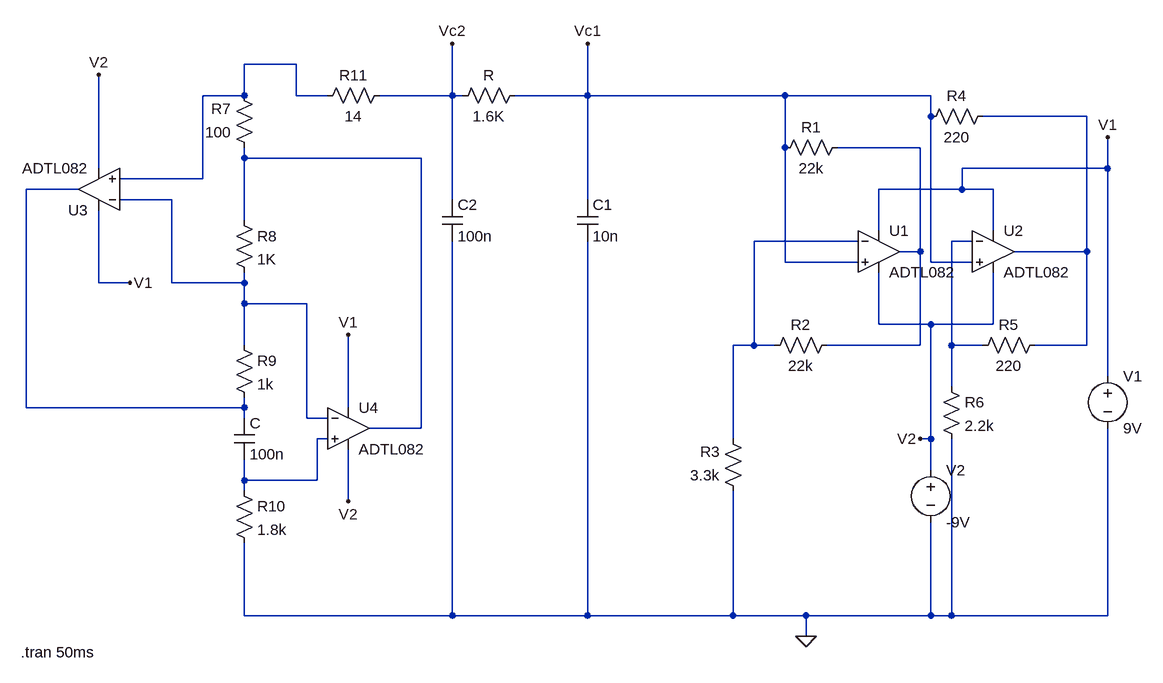
[diagram p0: schematic chua_circuit.asc]
chua_circuit.asc, the LTspice schematic file:
Version 4.1
SHEET 1 880 712
WIRE -592 -208 -672 -208
WIRE -672 -160 -672 -208
WIRE -672 -160 -736 -160
WIRE -592 -160 -592 -208
WIRE -544 -160 -592 -160
WIRE -352 -160 -352 -240
WIRE -352 -160 -464 -160
WIRE -336 -160 -352 -160
WIRE -144 -160 -144 -240
WIRE -144 -160 -256 -160
WIRE 160 -160 -144 -160
WIRE 384 -160 160 -160
WIRE 384 -128 384 -160
WIRE 624 -128 464 -128
WIRE 160 -80 160 -160
WIRE 368 -80 240 -80
WIRE -672 -64 -672 -80
WIRE -400 -64 -672 -64
WIRE -896 -48 -896 -192
WIRE 656 -48 656 -96
WIRE 656 -48 432 -48
WIRE -736 -32 -736 -160
WIRE -736 -32 -864 -32
WIRE -928 -16 -1008 -16
WIRE 432 -16 432 -48
WIRE 432 -16 304 -16
WIRE 480 -16 432 -16
WIRE -784 0 -864 0
WIRE -352 0 -352 -160
WIRE -144 0 -144 -160
WIRE -672 32 -672 -64
WIRE 304 48 304 -16
WIRE 480 48 480 -16
WIRE 272 64 112 64
WIRE 448 64 416 64
WIRE 368 80 368 -80
WIRE 368 80 336 80
WIRE 624 80 624 -128
WIRE 624 80 512 80
WIRE 160 96 160 -80
WIRE 272 96 160 96
WIRE 384 96 384 -128
WIRE 448 96 384 96
WIRE -896 128 -896 16
WIRE -848 128 -896 128
WIRE -784 128 -784 0
WIRE -672 128 -672 112
WIRE -672 128 -784 128
WIRE -672 160 -672 128
WIRE -576 160 -672 160
WIRE 304 192 304 112
WIRE 384 192 304 192
WIRE 480 192 480 112
WIRE 480 192 384 192
WIRE -672 224 -672 160
WIRE 112 224 112 64
WIRE 112 224 80 224
WIRE 144 224 112 224
WIRE 368 224 368 80
WIRE 368 224 224 224
WIRE 416 224 416 64
WIRE 464 224 416 224
WIRE 624 224 624 80
WIRE 624 224 544 224
WIRE 656 272 656 -48
WIRE 416 288 416 224
WIRE -1008 320 -1008 -16
WIRE -672 320 -672 304
WIRE -672 320 -1008 320
WIRE -512 320 -512 208
WIRE -672 336 -672 320
WIRE -576 336 -576 160
WIRE -544 336 -576 336
WIRE -400 352 -400 -64
WIRE -400 352 -480 352
WIRE -544 368 -560 368
WIRE 80 368 80 224
WIRE 384 368 384 192
WIRE 384 368 368 368
WIRE 384 416 384 368
WIRE -672 432 -672 400
WIRE -560 432 -560 368
WIRE -560 432 -672 432
WIRE -672 448 -672 432
WIRE -512 464 -512 384
WIRE -672 640 -672 528
WIRE -352 640 -352 64
WIRE -352 640 -672 640
WIRE -144 640 -144 64
WIRE -144 640 -352 640
WIRE 80 640 80 448
WIRE 80 640 -144 640
WIRE 192 640 80 640
WIRE 384 640 384 496
WIRE 384 640 192 640
WIRE 416 640 416 368
WIRE 416 640 384 640
WIRE 656 640 656 352
WIRE 656 640 416 640
WIRE 192 672 192 640
FLAG -848 128 V1
FLAG -512 208 V1
FLAG -512 464 V2
FLAG -896 -192 V2
FLAG -144 -240 Vc1
FLAG -352 -240 Vc2
FLAG 368 368 V2
FLAG 192 672 0
FLAG 656 -96 V1
SYMBOL OpAmps\\ADTL082 304 16 R0
SYMATTR InstName U1
SYMBOL OpAmps\\ADTL082 480 16 R0
SYMATTR InstName U2
SYMBOL OpAmps\\ADTL082 -896 48 R180
SYMATTR InstName U3
SYMBOL OpAmps\\ADTL082 -512 288 R0
SYMATTR InstName U4
SYMBOL voltage 656 256 R0
SYMATTR InstName V1
SYMATTR Value 9V
SYMBOL voltage 384 400 R0
WINDOW 123 0 0 Left 0
WINDOW 39 0 0 Left 0
SYMATTR InstName V2
SYMATTR Value -9V
SYMBOL res 256 -96 R90
WINDOW 0 0 56 VBottom 2
WINDOW 3 32 56 VTop 2
SYMATTR InstName R1
SYMATTR Value 22k
SYMBOL res 240 208 R90
WINDOW 0 0 56 VBottom 2
WINDOW 3 32 56 VTop 2
SYMATTR InstName R2
SYMATTR Value 22k
SYMBOL res 96 464 R180
WINDOW 0 36 76 Left 2
WINDOW 3 36 40 Left 2
SYMATTR InstName R3
SYMATTR Value 3.3k
SYMBOL res 368 -112 R270
WINDOW 0 32 56 VTop 2
WINDOW 3 0 56 VBottom 2
SYMATTR InstName R4
SYMATTR Value 220
SYMBOL res 448 240 R270
WINDOW 0 32 56 VTop 2
WINDOW 3 0 56 VBottom 2
SYMATTR InstName R5
SYMATTR Value 220
SYMBOL res 400 272 R0
SYMATTR InstName R6
SYMATTR Value 2.2k
SYMBOL cap -160 0 R0
SYMATTR InstName C1
SYMATTR Value 10n
SYMBOL cap -368 0 R0
SYMATTR InstName C2
SYMATTR Value 100n
SYMBOL res -240 -176 R90
WINDOW 0 0 56 VBottom 2
WINDOW 3 32 56 VTop 2
SYMATTR InstName R
SYMATTR Value 1.6K
SYMBOL res -688 16 R0
SYMATTR InstName R8
SYMATTR Value 1K
SYMBOL res -688 208 R0
SYMATTR InstName R9
SYMATTR Value 1k
SYMBOL res -688 432 R0
SYMATTR InstName R10
SYMATTR Value 1.8k
SYMBOL cap -688 336 R0
SYMATTR InstName C
SYMATTR Value 100n
SYMBOL res -448 -176 R90
WINDOW 0 0 56 VBottom 2
WINDOW 3 32 56 VTop 2
SYMATTR InstName R11
SYMATTR Value 14
SYMBOL res -656 -64 R180
WINDOW 0 36 76 Left 2
WINDOW 3 36 40 Left 2
SYMATTR InstName R7
SYMATTR Value 100
TEXT -1016 696 Left 2 !.tran 50ms

The netlist it stands for:
* chua_circuit.asc
X§U1 Vc1 N007 V1 V2 N003 ADTL082  ; pins In+ In- V+ V- OUT
X§U2 Vc1 N008 V1 V2 N002 ADTL082  ; pins In+ In- V+ V- OUT
X§U3 N001 N006 V1 V2 N005 ADTL082  ; pins In+ In- V+ V- OUT
X§U4 N009 N006 V1 V2 N004 ADTL082  ; pins In+ In- V+ V- OUT
V1 V1 0 9V
V2 V2 0 -9V
R1 N003 Vc1 22k
R2 N003 N007 22k
R3 0 N007 3.3k
R4 Vc1 N002 220
R5 N008 N002 220
R6 N008 0 2.2k
C1 Vc1 0 10n
C2 Vc2 0 100n
R Vc1 Vc2 1.6K
R8 N004 N006 1K
R9 N006 N005 1k
R10 N009 0 1.8k
C N005 N009 100n
R11 Vc2 N001 14
R7 N004 N001 100
.tran 50ms
.lib ADI.lib
.backanno
.end